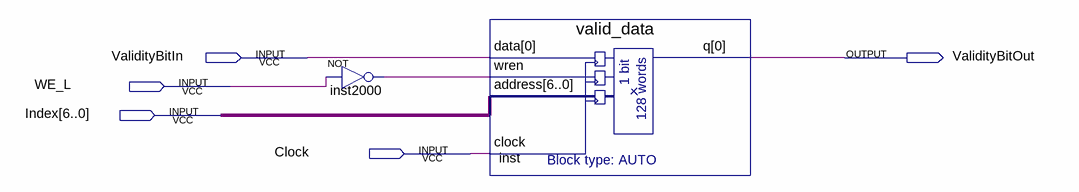
[diagram p0: schematic sheet]
// Quartus schematic Valid.bdf as structural Verilog: 2 symbols, 5 pins
module Valid (
  input  ValidityBitIn,
  input  WE_L,
  input  [6:0] Index,
  input  Clock,
  output ValidityBitOut
);

  wire inst2000_out;

  not inst2000 (inst2000_out, WE_L);
  valid_data inst (.data(ValidityBitIn), .wren(inst2000_out), .address(Index), .clock(Clock), .q(ValidityBitOut));
endmodule
